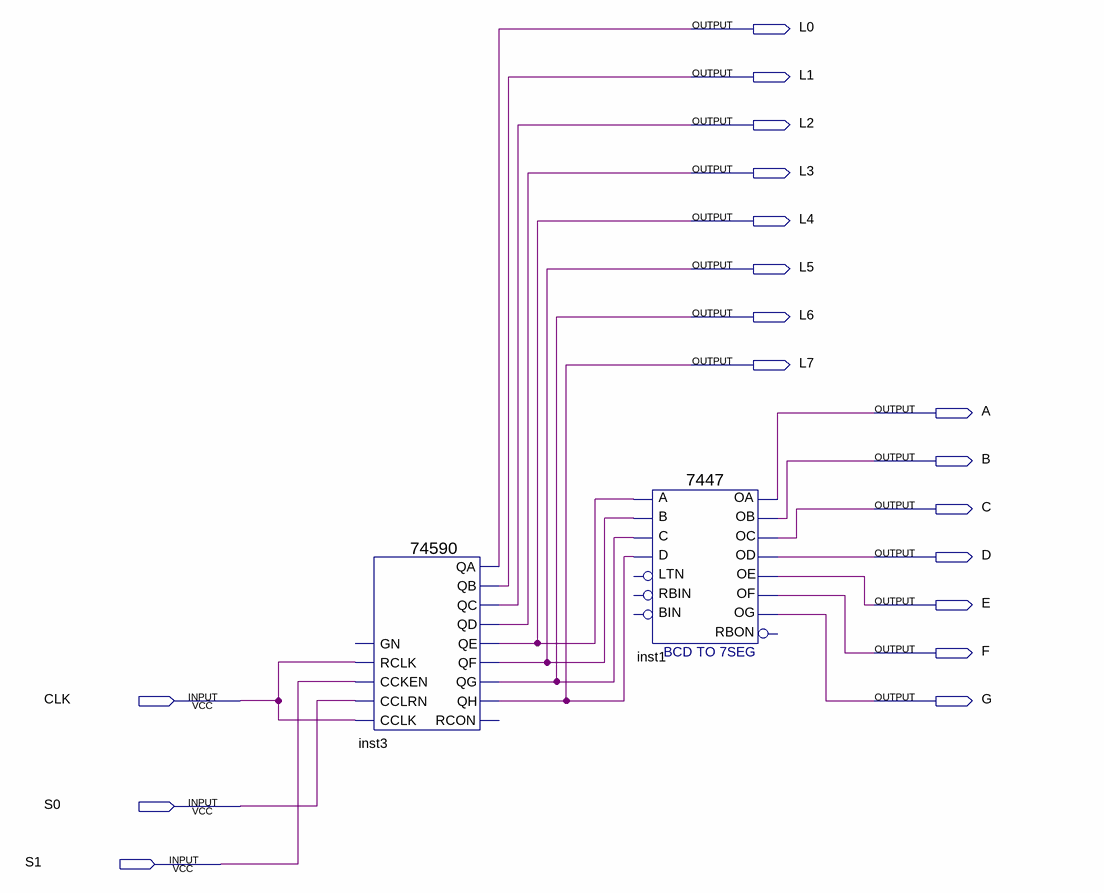
[diagram p0: schematic sheet]
// Quartus schematic exercise1.bdf as structural Verilog: 2 symbols, 18 pins
module exercise1 (
  input  CLK,
  input  S0,
  input  S1,
  output L0,
  output L1,
  output L2,
  output L3,
  output L4,
  output L5,
  output L6,
  output L7,
  output A,
  output B,
  output C,
  output D,
  output E,
  output F,
  output G
);

  \74590  inst3 (
    .CCLRN(S0), .CCLK(CLK), .RCLK(CLK), .CCKEN(S1), .QH(L7), .QG(L6), .QF(L5), .QE(L4), .QC(L2), .QD(L3),
    .QB(L1), .QA(L0));  // open: GN, RCON
  \7447  inst1 (
    .B(L5), .C(L6), .D(L7), .A(L4), .OB(B), .OC(C), .OE(E), .OD(D), .OF(F), .OG(G), .OA(A));  // open: LTN, RBIN, BIN, RBON
endmodule
